# EAGLE design Simple-Bug-2N918 (EAGLE 7.6.0)
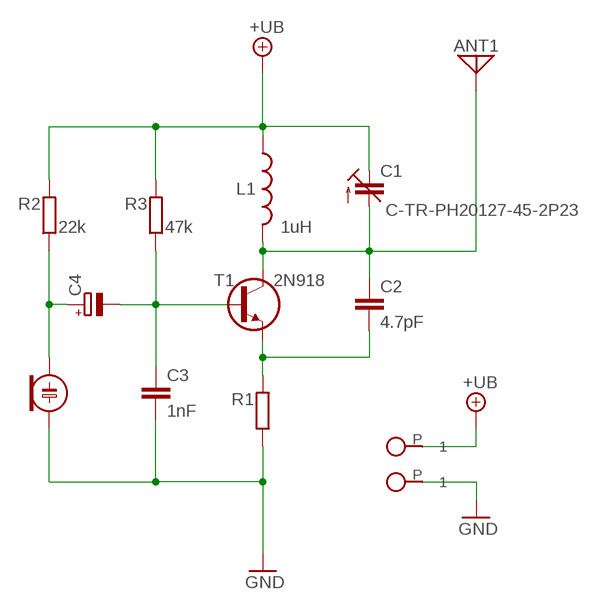
[diagram p0: schematic, sheet 1]

## Parts
+  SPAD  [SPAD]
ANT1  ANT  [SPAD]
C1  C-TR-PH20127-45-2P23  [TRIM808-45]
C2  4.7pF  C025-020X036  [C025-020X036]
C3  1nF  C025-020X036  [C025-020X036]
C4  CPOLE2,5-3  [E2,5-3]
ECM  ECM-5  [ECM-5]
L1  1uH  L04/7  [L-04/7]
R1  R0202V  [0202V]
R2  22k  R0202/5  [0202/5]
R3  47k  R0202/5  [0202/5]
T1  2N918  2N918TO-72-A45  [TO-72-A45]
̶̶  SPAD  [SPAD]

## Nets
+UB: +.P C1.3(E) L1.1 R2.2 R3.2
GND: C3.2 ECM.1(+) R1.1 ̶̶.P
N$1: ANT1.P C1.2(A) C2.1 L1.2 T1.3(C)
N$3: C2.2 R1.2 T1.1(E)
N$5: C3.1 C4.- R3.1 T1.2(B)
N$6: C4.+ ECM.2(-) R2.1

## Library data of the parts
+ ̶̶ = pad:SPAD
ANT1 = pad:ANT
C1 = cap-trim:C-TR-PH20127
C2 C3 = c:C: CAPACITOR, European symbol
C4 = c:CPOL: POLARIZED CAPACITOR, European symbol
ECM = ECM:ECM-5
L1 = r:L
R1-R3 = r:R: RESISTOR, European symbol
T1 = t:2N918

## Net classes
0 default: width 0.813 mm

## Board
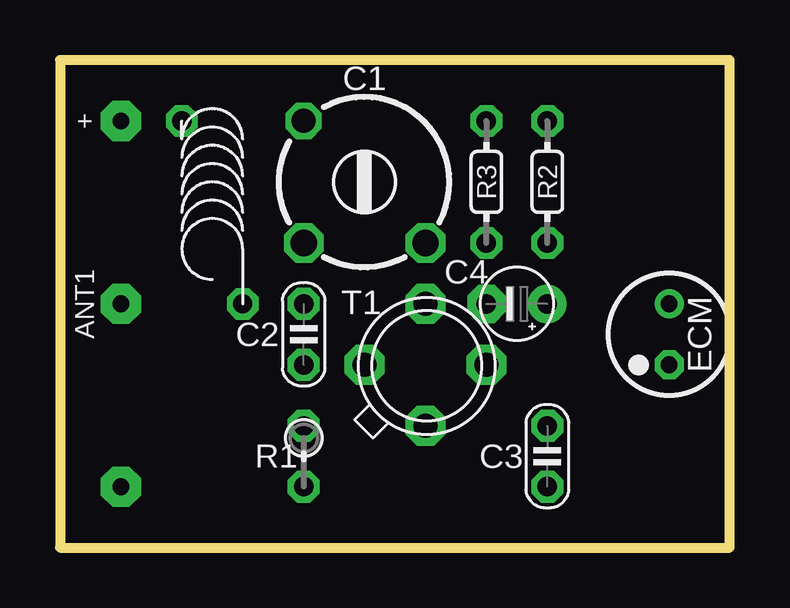
[diagram p1: board, top side]
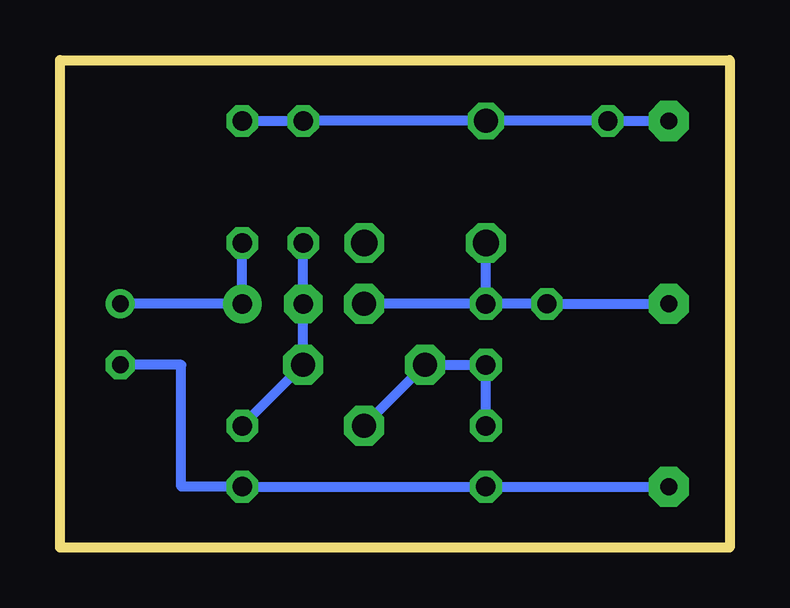
[diagram p2: board, bottom side, seen from below]

Size 27.92 x 20.32 mm. Coordinates in mm from the lower left corner, seen from the top.
Outline: 0,0 27.92,0 27.92,20.32 0,20.32 0,0
Copper layers (1*16): Top 0.035mm / dielectric 1.5mm / Bottom 0.035mm
Design rules "default": minimum track width 10mil, minimum drill 24mil, track to track 8mil, track to pad 8mil, pad to pad 8mil, via to via 8mil, smd to smd 8mil, copper to edge 40mil, drill to drill 8mil, minimum pad ring 10mil, minimum via ring 8mil, stop-mask expansion 4mil, vias tented up to drill 0mil, thermal gap 10mil

### Footprints (pad centres in the part's own frame; a part is rotated, then mirrored left to right if it is on the bottom)
SPAD = drill 0.7 pad 1.676 octagon: P 0,0
TRIM808-45 = drill 1.1 octagon: 1 2.54,-2.54; 2 -2.54,-2.54 | drill 1 octagon: 3 -2.54,2.54
C025-020X036 = drill 0.813 octagon: 1 0,1.27; 2 0,-1.27
E2,5-3 = drill 0.813 pad 1.6: + 1.27,0 | drill 0.813 pad 1.6 octagon: - -1.27,0
ECM-5 = drill 0.7 pad 1.2 octagon: 1 0,1.27 | drill 0.7 pad 1.2: 2 0,-1.27
L-04/7 = drill 0.8 octagon: 1 -1.27,3.81; 2 1.27,-3.81
0202V = drill 0.813 octagon: 1 0,-1.27; 2 0,1.27
0202/5 = drill 0.813 octagon: 1 0,-2.54; 2 0,2.54
TO-72-A45 = drill 1 pad 1.676 octagon: 1 0,-2.54; 2 2.54,0; 3 0,2.54; 4 -2.54,0

### Placement (x,y rotation side)
+  2.54,17.78 180 top
ANT1  2.54,10.16 180 top
C1  12.7,15.24 0 top
C2  10.16,8.89 0 top
C3  20.32,3.81 0 top
C4  19.05,10.16 0 top
ECM  25.4,8.89 180 top
L1  6.35,13.97 0 top
R1  10.16,3.81 0 top
R2  20.32,15.24 0 top
R3  17.78,15.24 0 top
T1  15.24,7.62 0 top
̶̶  2.54,2.54 180 top

### Tracks (layer width: path | path; a pad name or v marks a point on that pad's centre or on a via)
+UB
  Bottom 0.406: R2.2 R3.2 C1.3 L1.1 +.P
GND
  Bottom 0.406: ECM.1 22.86,7.62 22.86,2.54 C3.2 R1.1 ̶̶.P
N$1
  Bottom 0.406: C2.1 T1.3 | C2.1 L1.2 ANT1.P | C2.1 C1.2
N$3
  Bottom 0.406: R1.2 C2.2 12.7,7.62 T1.1
N$5
  Bottom 0.406: T1.2 R3.1 | C3.1 T1.2 | T1.2 C4.-
N$6
  Bottom 0.406: ECM.2 C4.+ R2.1